# EAGLE design M8_PCB (EAGLE 9.4.2)
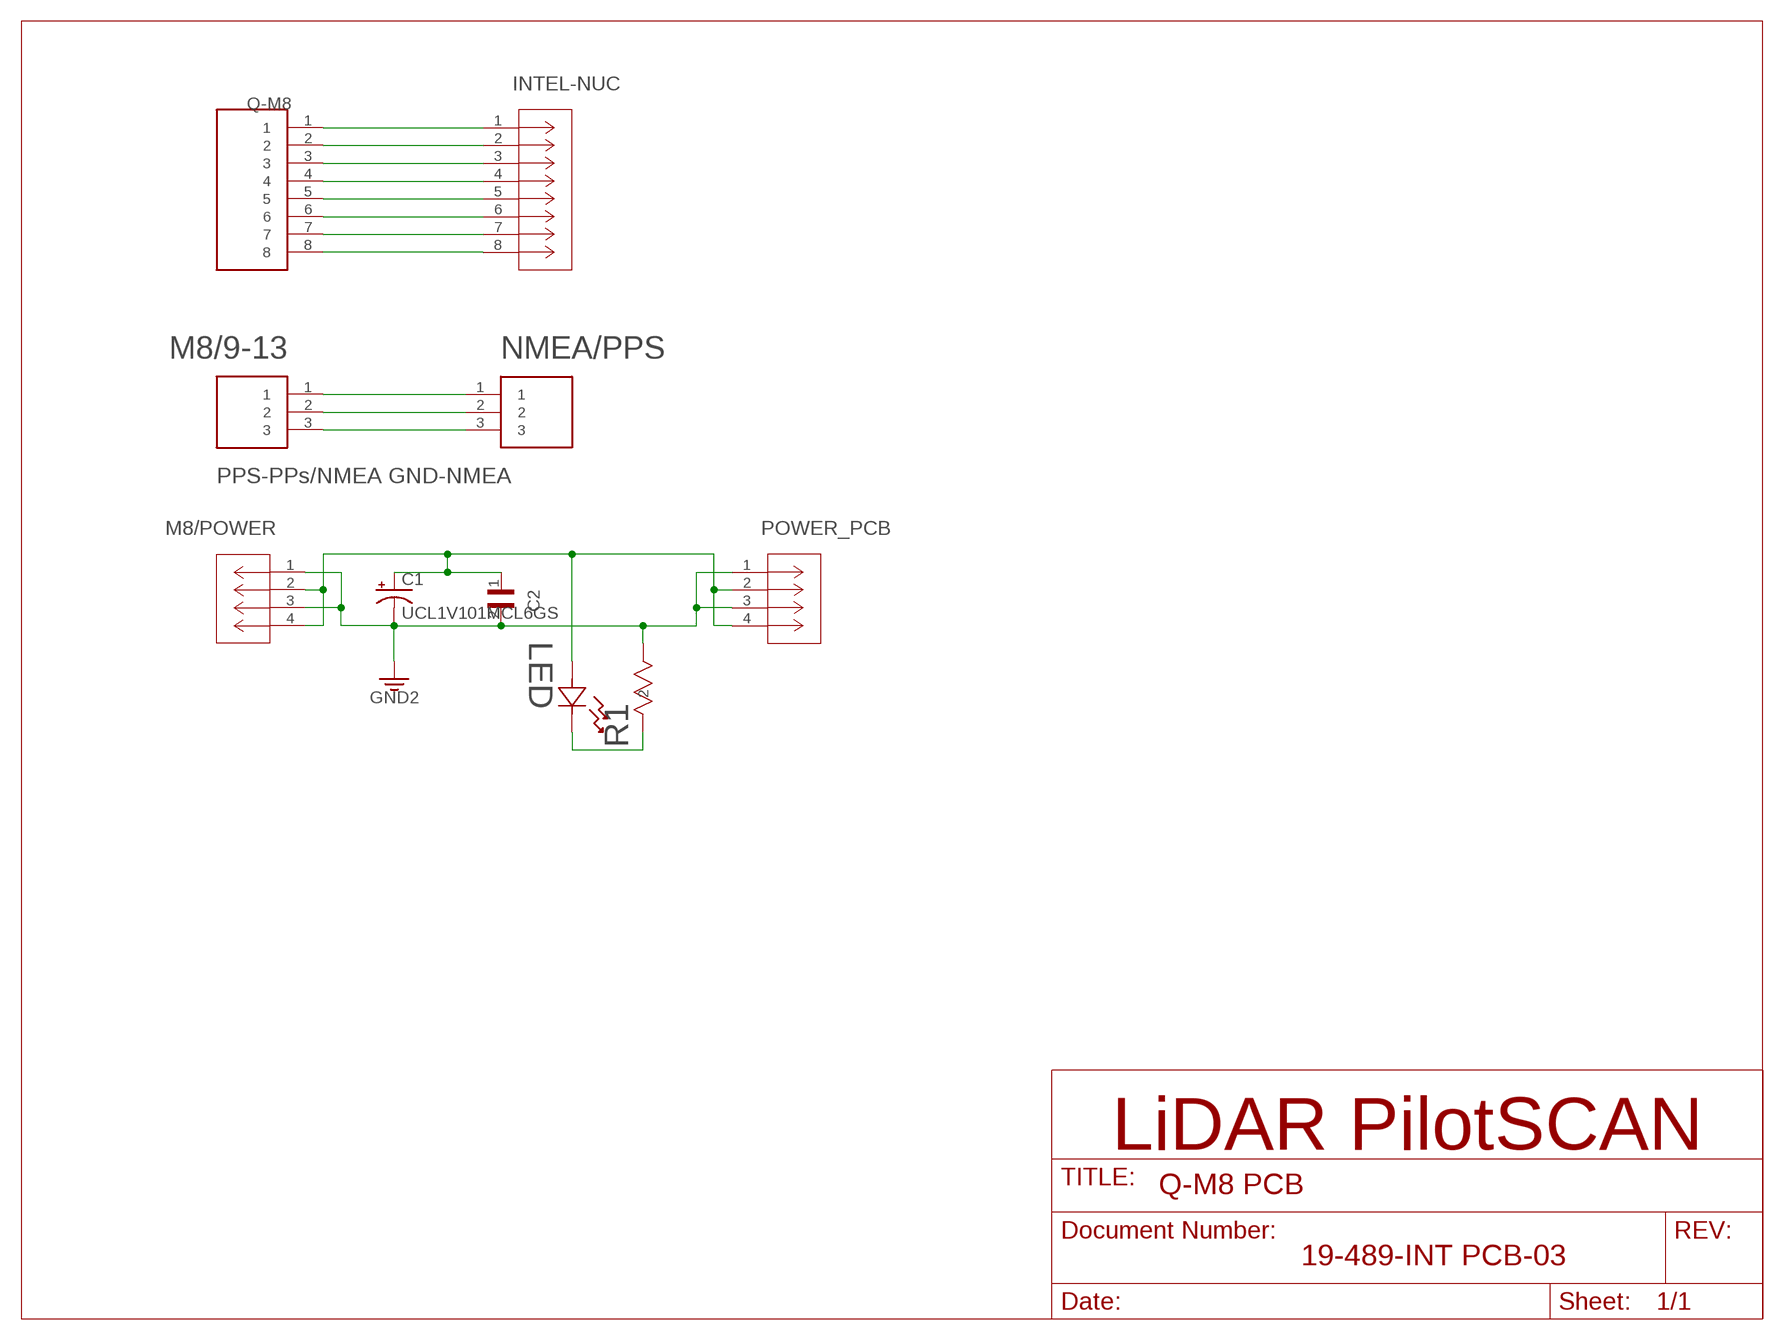
[diagram p0: schematic, sheet 1]

## Parts
C1  UCL1V101MCL6GS  [U2-K]
C2  GRM033R6YA104KE14D  [CAPC0603X33N]
INTEL-NUC  LLC  [0955032881]
LED  VLMC3100-GS08  [LED_PLCC_VSMB]
M8/9-13  1-2834021-3  [CONN_1-2834021-3]
M8/POWER  3-794630-4  [CON4_2X2_P3MM_VMNL2]
NMEA/PPS  1-2834021-3  [CONN_1-2834021-3]
POWER_PCB  3-794630-4  [CON4_2X2_P3MM_VMNL2]
Q-M8  292133-8  [TE_292133-8]
R1  CRCW04026K80FKEDHP  [RES_CRCW_0402]

## Nets
GROUND: C1.2(-) C2.2 M8/POWER.1 M8/POWER.3 POWER_PCB.1 POWER_PCB.3 R1.1 ; supply symbol labelled GND2
N$1: INTEL-NUC.1 Q-M8.1
N$2: INTEL-NUC.2 Q-M8.2
N$3: INTEL-NUC.3 Q-M8.3
N$4: INTEL-NUC.4 Q-M8.4
N$5: INTEL-NUC.5 Q-M8.5
N$6: INTEL-NUC.6 Q-M8.6
N$7: INTEL-NUC.7 Q-M8.7
N$8: INTEL-NUC.8 Q-M8.8
N$9: M8/9-13.1 NMEA/PPS.1
N$10: M8/9-13.2 NMEA/PPS.2
N$11: M8/9-13.3 NMEA/PPS.3
N$14: LED.1 R1.2
POWER+: C1.1(+) C2.1 LED.2 M8/POWER.2 M8/POWER.4 POWER_PCB.2 POWER_PCB.4

## Notes on the sheet
- PPS-PPs/NMEA GND-NMEA

## Library data of the parts
C1 = UCL1V101MCL6GS:UCL1V101MCL6GS; MANUFACTURER_PART_NUMBER: UCL1V101MCL6GS; VENDOR: Nichicon
C2 = GRM033R6YA104KE14D:GRM033R6YA104KE14D: CAP CER 0.1UF 35V X5R 0201; DESCRIPTION: Cap 0.1uf 35vdc X5r 10% Smd 0201 Paper Tape; DIGI-KEY_PART_NUMBER: 490-10430-1-ND; DIGI-KEY_PURCHASE_URL: https://www.digikey.com.co/product-detail/en/murata-electronics/GRM033R6YA104KE14D/490-10430-1-ND/5026320?utm_source=snapeda&utm_medium=aggregator&utm_campaign=symbol; MF: Murata Electronics; MP: GRM033R6YA104KE14D; PACKAGE: 0603 Taiyo Yuden
INTEL-NUC = 0955032881:LLC; MANUFACTURER_PART_NUMBER: LLC; VENDOR: Molex Connector Corporation
LED = VLMC3100-GS08:VLMC3100-GS08; MANUFACTURER_PART_NUMBER: VLMC3100GS08; VENDOR: Vishay
M8/9-13 NMEA/PPS = 1-2834021-3:1-2834021-3: Conn PC Terminal Block RCP 3 POS 2.5mm Solder ST Thru-Hole 5A/Contact Box/Carton; COMMENT: 1-2834021-3; DESCRIPTION: Conn PC Terminal Block RCP 3 POS 2.5mm Solder ST Thru-Hole 5A/Contact Box/Carton; DIGI-KEY_PART_NUMBER: A123845-ND; DIGI-KEY_PURCHASE_URL: https://www.digikey.com.co/product-detail/en/te-connectivity-amp-connectors/1-2834021-3/A123845-ND/5872961?utm_source=snapeda&utm_medium=aggregator&utm_campaign=symbol; MF: TE Connectivity; MP: 1-2834021-3; PACKAGE: None; TE_PURCHASE_URL: https://www.te.com/usa-en/product-1-2834021-3.html?te_bu=Cor&te_type=disp&te_campaign=seda_glo_cor-seda-global-disp-prtnr-fy19-seda-model-bom-cta_sma-317_1&elqCampaignId=32493
M8/POWER POWER_PCB = 3-794630-4:3-794630-4; MANUFACTURER_PART_NUMBER: 37946304; VENDOR: TE Connectivity
Q-M8 = 292133-8:292133-8; COMMENT: 292133-8; DESCRIPTION: AMP CT 8 Position Through Hole Single Row Vertical Wire to Board Shrouded Header; DIGI-KEY_PART_NUMBER: A100950-ND; DIGI-KEY_PURCHASE_URL: https://www.digikey.com/product-detail/en/te-connectivity-amp-connectors/292133-8/A100950-ND/2272959?utm_source=snapeda&utm_medium=aggregator&utm_campaign=symbol; EU_ROHS_COMPLIANCE: Compliant; MF: TE Connectivity; MP: 292133-8; PACKAGE: None; TE_PURCHASE_URL: https://www.te.com/usa-en/product-292133-8.html?te_bu=Cor&te_type=disp&te_campaign=seda_glo_cor-seda-global-disp-prtnr-fy19-seda-model-bom-cta_sma-317_1&elqCampaignId=32493
R1 = CRCW04026k80FKEDHP:CRCW04026K80FKEDHP; MANUFACTURER_PART_NUMBER: CRCW04026K80FKEDHP; VENDOR: Vishay

## Net classes
0 default: width 0.254 mm, drill 0.508 mm, clearance 0.254 mm
1 Style_1: width 1.524 mm, drill 0.254 mm

## Board
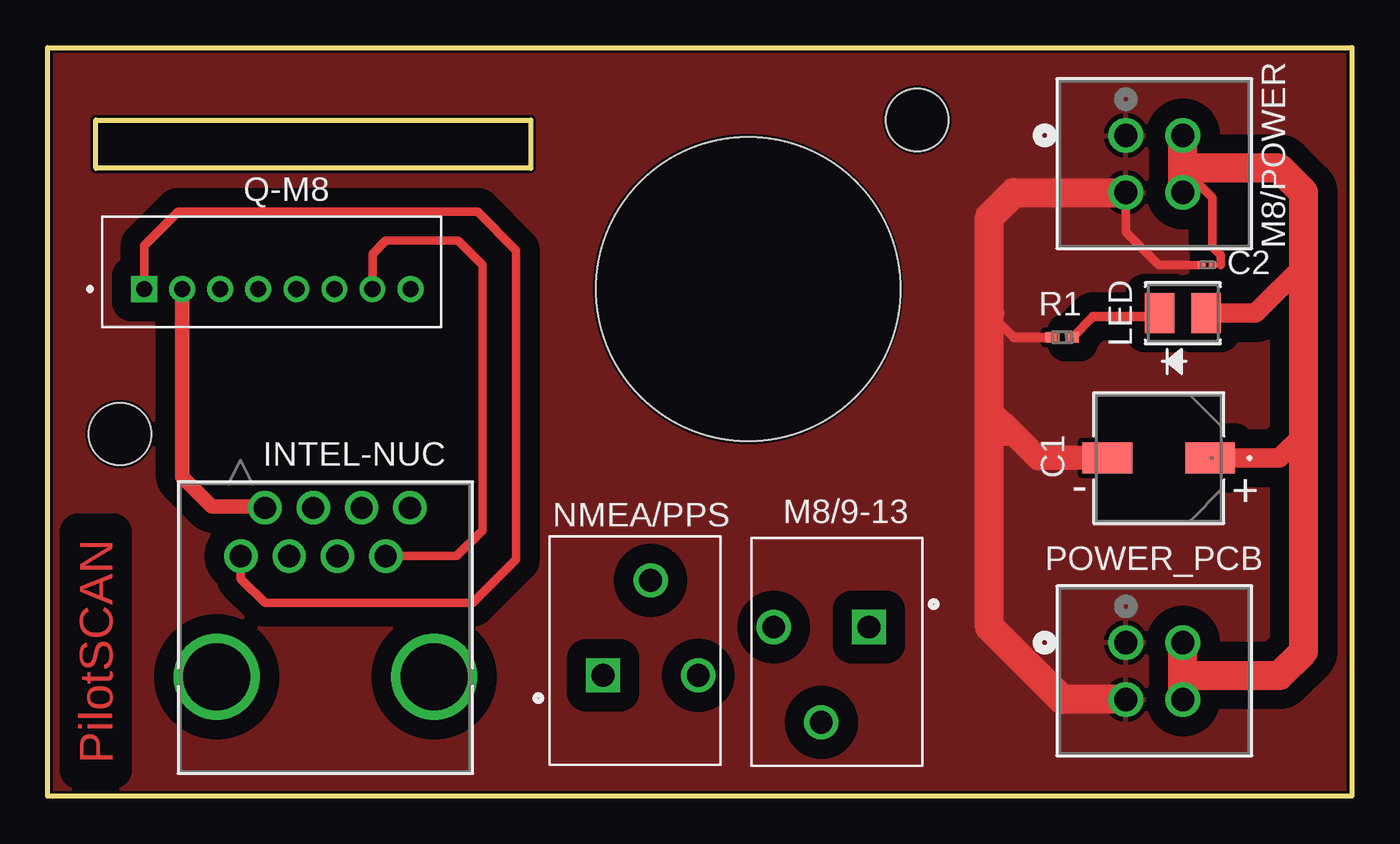
[diagram p1: board, top side]
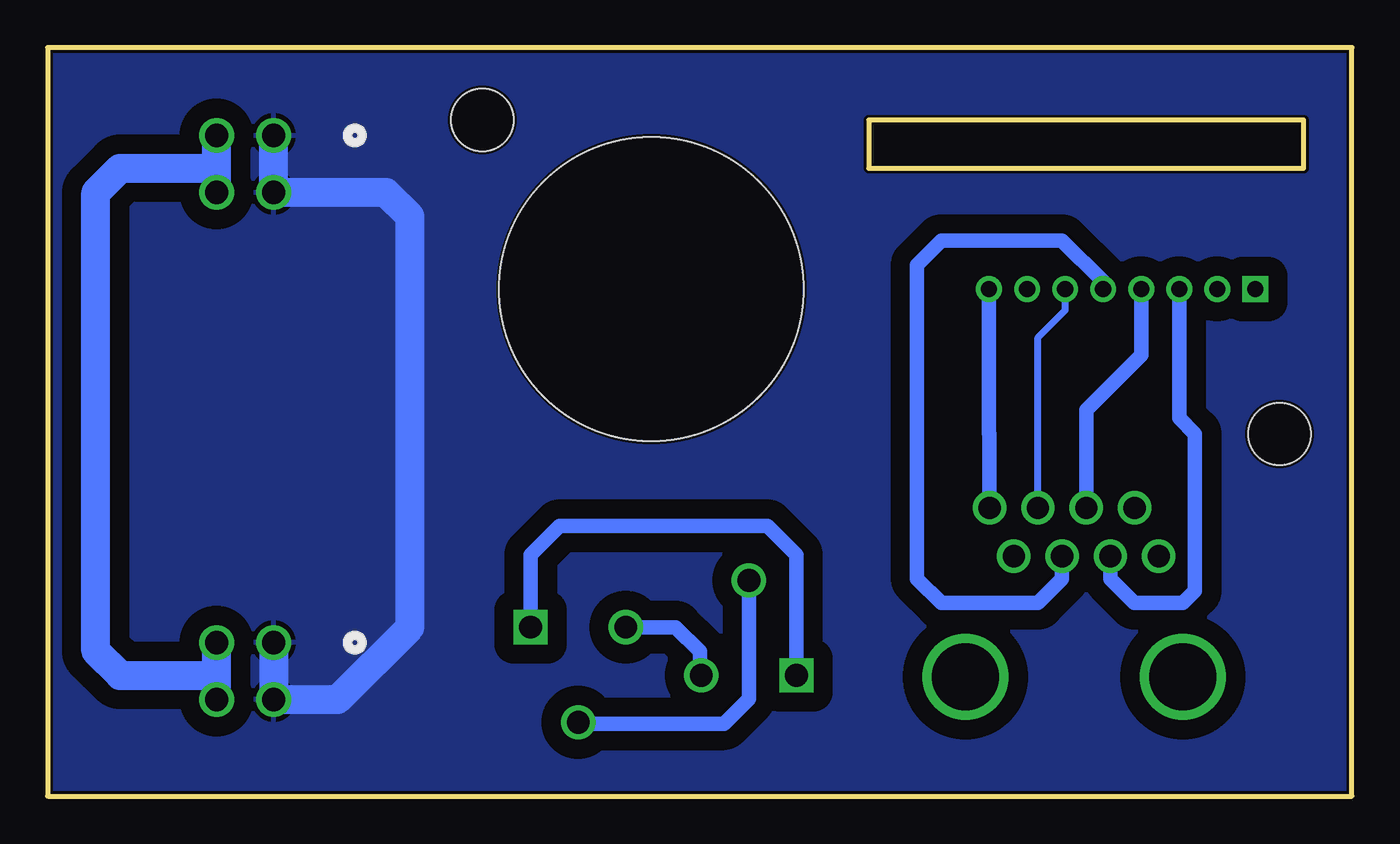
[diagram p2: board, bottom side, seen from below]

Size 68.58 x 39.37 mm. Coordinates in mm from the lower left corner, seen from the top.
Outline: 68.58,0 0,0 0,39.37 68.58,39.37 68.58,0
Outline: 25.4,33.02 2.54,33.02 2.54,35.56 25.4,35.56 25.4,33.02
Copper layers (1*16): Top 0.035mm / dielectric 1.5mm / Bottom 0.035mm
Design rules "default *": minimum track width 6mil, minimum drill 0.35mm, track to track 40mil, track to pad 20mil, pad to pad 20mil, via to via 40mil, smd to smd 20mil, copper to edge 6mil, drill to drill 6mil, minimum pad ring 10mil, minimum via ring 8mil, stop-mask expansion 4mil, vias tented up to drill 0mil, thermal gap 10mil
Holes 3.28 mm at 3.81,19.05 45.72,35.56
Holes 16 mm at 36.83,26.67

### Footprints (pad centres in the part's own frame; a part is rotated, then mirrored left to right if it is on the bottom)
U2-K = smd 2.616 x 1.626: 1 -2.705,0; 2 2.705,0
CAPC0603X33N = smd 0.38 x 0.4: 1 -0.281,0; 2 0.281,0
0955032881 = drill 1.168 pad 1.676: 1 -8.89,12.624; 2 -7.62,15.164; 3 -6.35,12.624; 4 -5.08,15.164; 5 -3.81,12.624; 6 -2.54,15.164; 7 -1.27,12.624; 8 0,15.164 | drill 3.505 pad 3.505: 9 -10.16,6.274; 10 1.27,6.274
LED_PLCC_VSMB = smd 1.549 x 2.108: 1 -1.232,0; 2 1.232,0
CONN_1-2834021-3 = drill 1.2 square: 1 0,0 | drill 1.2: 2 2.5,5; 3 5,0
CON4_2X2_P3MM_VMNL2 = drill 1.219 pad 1.727: 1 -2.997,2.997; 2 0,2.997; 3 -2.997,0; 4 0,0
TE_292133-8 = drill 0.85 pad 1.2 square: 1 0,0 | drill 0.85 pad 1.2: 2 -2,0; 3 -4,0; 4 -6,0; 5 -8,0; 6 -10,0; 7 -12,0; 8 -14,0
RES_CRCW_0402 = smd 0.66 x 0.559: 1 -0.546,0; 2 0.546,0

### Placement (x,y rotation side)
C1  58.42,17.78 180 top
C2  60.96,27.94 180 top
INTEL-NUC  19.05,0 0 top
LED  59.69,25.4 0 top
M8/9-13  43.18,8.89 180 top
M8/POWER  59.69,31.75 0 top
NMEA/PPS  29.21,6.35 0 top
POWER_PCB  59.69,5.08 0 top
Q-M8  5.08,26.67 180 top
R1  53.34,24.13 0 top

### Tracks (layer width: path | path; a pad name or v marks a point on that pad's centre or on a via)
GROUND
  Top 0.457: M8/POWER.3 56.69,29.67 58.42,27.94 C2.2
  Top 0.508: R1.1 50.8,24.13 49.53,25.4
  Top 0.762: 55.64,18.05 C1.2
  Top 1.27: C1.2 52.07,17.78 50.8,19.05 | 50.8,19.05 49.53,19.05 | 50.8,19.05 49.53,20.32
  Top 1.524: M8/POWER.3 50.8,31.75 49.53,30.48 49.53,25.4 49.53,20.32 49.53,19.05 49.53,8.89 53.34,5.08 POWER_PCB.3
  Bottom 1.524: POWER_PCB.1 POWER_PCB.3 53.34,5.08 49.53,8.89 49.53,30.48 50.8,31.75 M8/POWER.3 M8/POWER.1
  pour Bottom: 0,39.37 0,0 68.58,0 68.58,39.37
  pour Top: 0,39.37 0,0 68.58,0 68.58,39.37
N$1
  Top 0.457: INTEL-NUC.1 10.16,11.43 11.43,10.16 22.35,10.16 24.64,12.45 24.64,28.7 22.61,30.73 6.86,30.73 5.08,28.96 Q-M8.1
N$2
  Top 0.762: INTEL-NUC.2 11.35,15.24 8.64,15.24 7.08,16.8 Q-M8.2
N$3
  Bottom 0.762: INTEL-NUC.3 12.7,11.43 11.43,10.16 8.89,10.16 8.25,10.79 8.25,19.05 9.08,19.88 Q-M8.3
N$4
  Bottom 0.762: INTEL-NUC.4 13.97,20.32 11.08,23.21 Q-M8.4
N$5
  Bottom 0.762: Q-M8.5 13.08,27.05 15.24,29.21 21.59,29.21 22.86,27.94 22.86,11.43 21.59,10.16 16.51,10.16 15.24,11.43 INTEL-NUC.5
N$6
  Bottom 0.381: INTEL-NUC.6 16.51,24.13 15.08,25.56 Q-M8.6
N$7
  Top 0.457: Q-M8.7 17.08,28.51 17.78,29.21 21.59,29.21 22.86,27.94 22.86,13.97 21.51,12.62 INTEL-NUC.7
N$8
  Bottom 0.762: INTEL-NUC.8 19.05,19.05 19.08,19.08 Q-M8.8
N$9
  Bottom 0.762: NMEA/PPS.1 29.21,12.7 30.73,14.22 41.66,14.22 43.18,12.7 M8/9-13.1
N$10
  Bottom 0.762: M8/9-13.2 40.6,3.81 33.02,3.81 31.71,5.12 NMEA/PPS.2
N$11
  Bottom 0.762: NMEA/PPS.3 34.29,6.43 34.29,7.62 35.56,8.89 M8/9-13.3
N$14
  Top 0.508: R1.2 54.97,25.21 58.46,25.21
  Top 0.762: 58.46,25.21 LED.1
POWER+
  Top 0.254: C2.1 61.69,27.94
  Top 0.457: 59.69,33.02 61.24,31.47 61.24,28.91 61.69,28.47 61.69,27.94
  Top 1.016: C1.1 64.77,17.78 66.04,19.05 | LED.2 63.5,25.4 66.04,27.94
  Top 1.524: POWER_PCB.4 59.69,6.35 | 59.69,6.35 POWER_PCB.2 | 59.69,33.02 64.77,33.02 66.04,31.75 66.04,27.94 66.04,19.05 66.04,7.62 64.77,6.35 59.69,6.35 | M8/POWER.4 59.69,33.02 | 59.69,33.02 M8/POWER.2
  Bottom 1.524: POWER_PCB.4 59.69,6.35 | 59.69,6.35 POWER_PCB.2 | 59.69,33.02 64.77,33.02 66.04,31.75 66.04,7.62 64.77,6.35 59.69,6.35 | 59.69,33.02 M8/POWER.2 | M8/POWER.4 59.69,33.02

### Text on the board
Top: PilotSCAN
tNames: - | +